# EAGLE design telecommandeV (EAGLE 8.0.2)
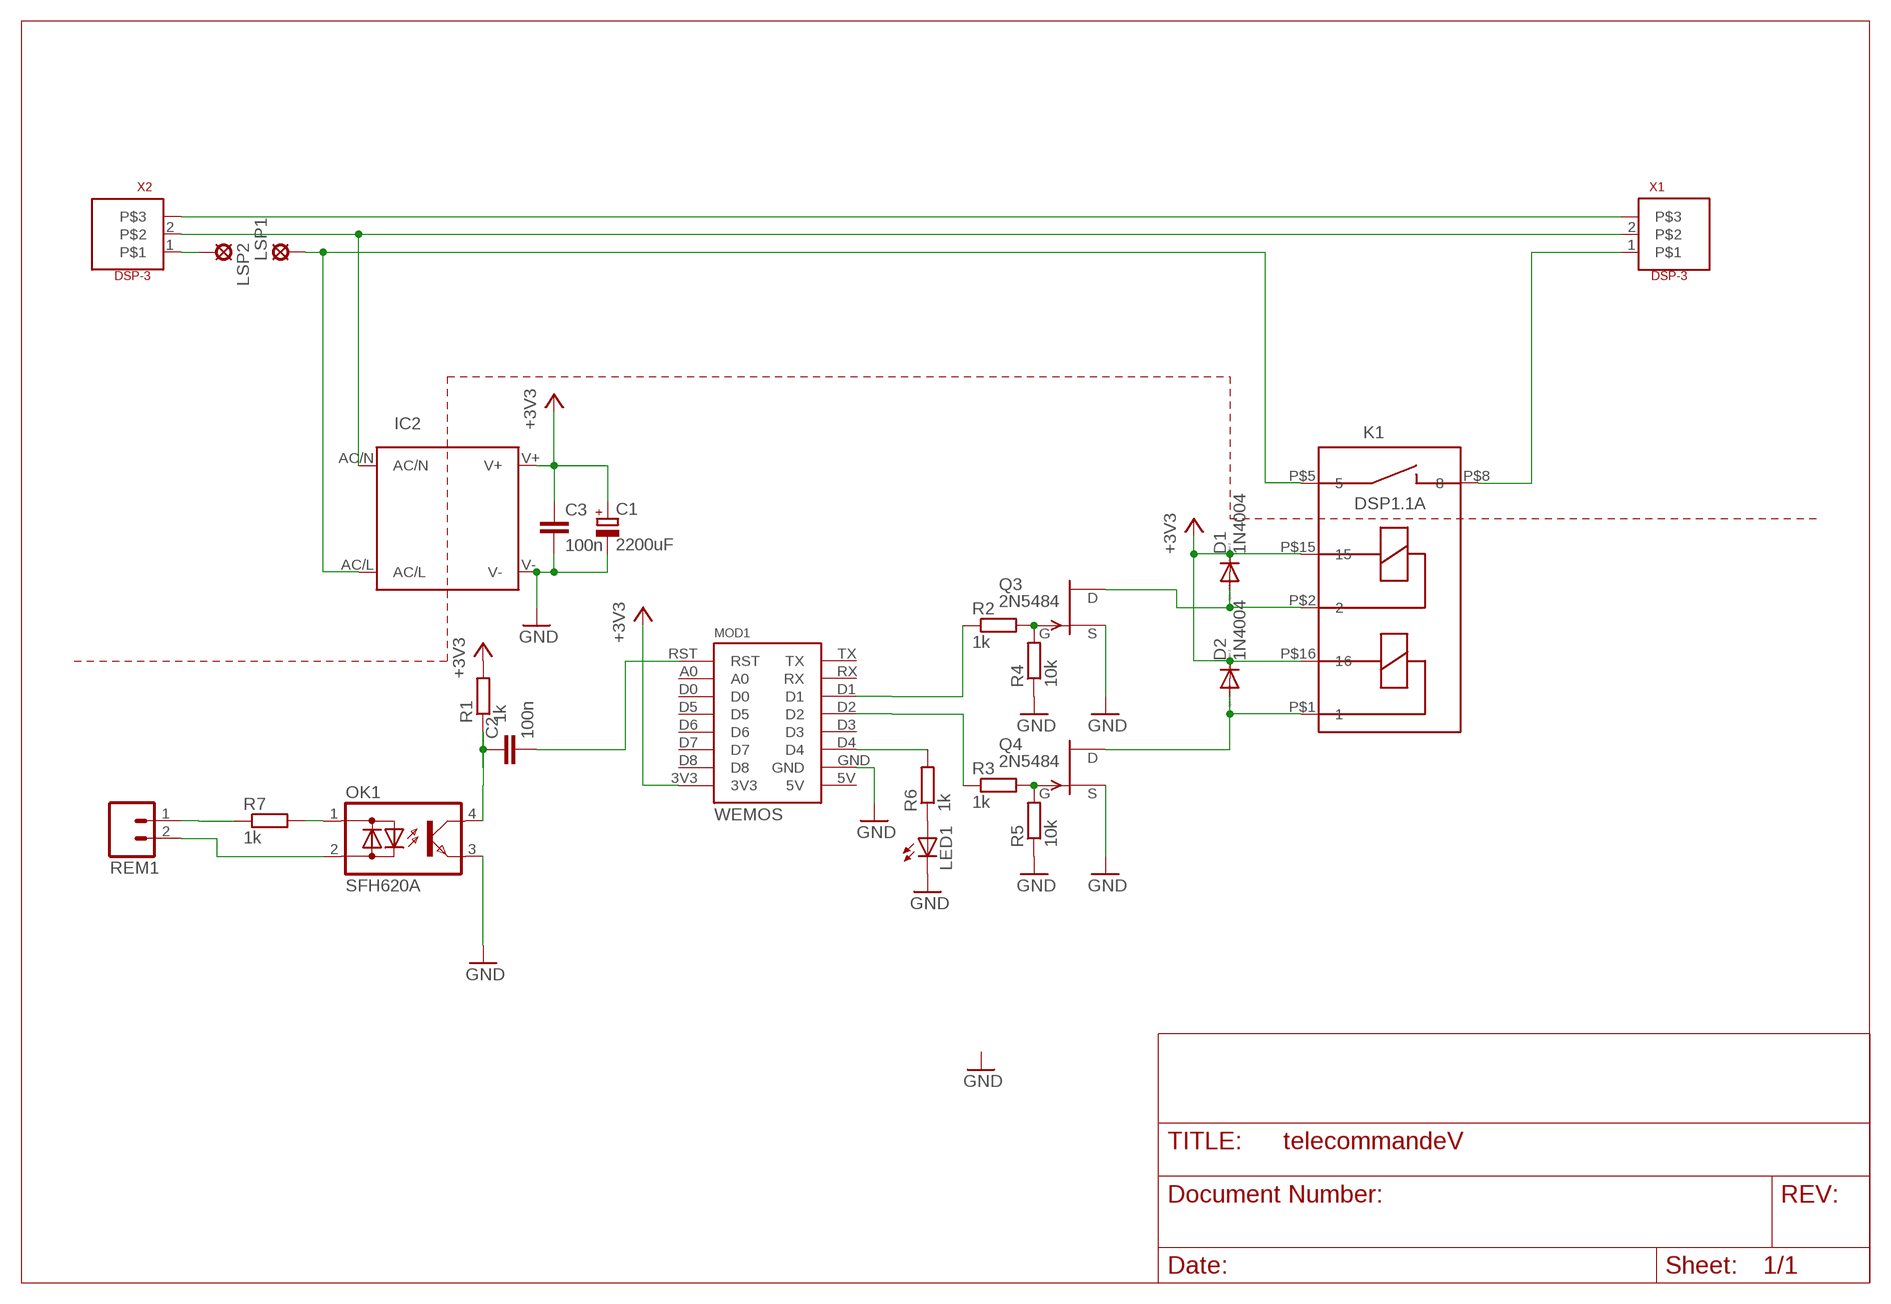
[diagram p0: schematic, sheet 1]

## Parts
C1  2200uF  CPOL-EUE3.5-10  [E3,5-10]
C2  100n  C-EU025-024X044  [C025-024X044]
C3  100n  C-EU025-024X044  [C025-024X044]
D1  1N4004  [DO41-10]
D2  1N4004  [DO41-10]
IC2  IRM_03  [IRM_03]
K1  DSP1.1A  [DSP1A]
LED1  LED3MM  [LED3MM]
LSP1  SE14  [SE14]
LSP2  SE14  [SE14]
MOD1  WEMOS  [WEMOS]
OK1  SFH620A  [DIL04]
Q3  2N5484  [TO92-]
Q4  2N5484  [TO92-]
R1  1k  R-EU_0204/7  [0204/7]
R2  1k  R-EU_0204/7  [0204/7]
R3  1k  R-EU_0204/7  [0204/7]
R4  10k  R-EU_0204/7  [0204/7]
R5  10k  R-EU_0204/7  [0204/7]
R6  1k  R-EU_0204/7  [0204/7]
R7  1k  R-EU_0207/10  [0207/10]
REM1  M025MM  [SCREWTERMINAL-5MM-2]
X1  DSP-3  [RND-CONNECT-3]
X2  DSP-3  [RND-CONNECT-3]

## Nets
+3V3: C1.+ C3.1 D1.C D2.C IC2.V+ K1.P$15 K1.P$16 MOD1.3V3 R1.2
GND: C1.- C3.2 IC2.V- LED1.K(C) MOD1.GND OK1.3(E) Q3.2(S) Q4.2(S) R4.1 R5.1
MASSE [RESEAU]: X1.3 X2.3
N$1: Q3.1(G) R2.2 R4.2
N$2: Q4.1(G) R3.2 R5.2
N$3: D1.A K1.P$2 Q3.3(D)
N$4: MOD1.D4 R6.2
N$5: C2.2 MOD1.RST
N$6: D2.A K1.P$1 Q4.3(D)
N$8 [RESEAU]: K1.P$8 X1.1
N$9: R7.1 REM1.1
N$10: LED1.A R6.1
N$11: OK1.1(AC1) R7.2
N$12: MOD1.D1 R2.1
N$13: MOD1.D2 R3.1
N$15: OK1.2(AC2) REM1.2
N$16: C2.1 OK1.4(C) R1.1
NEUTRE [RESEAU]: IC2.AC/N X1.2 X2.2
PHASE [RESEAU]: LSP2.MP X2.1
PHASE_B [RESEAU]: IC2.AC/L K1.P$5 LSP1.MP
Unconnected: MOD1.5V MOD1.A0 MOD1.D0 MOD1.D3 MOD1.D5 MOD1.D6 MOD1.D7 MOD1.D8 MOD1.RX MOD1.TX

## Library data of the parts
C1 = rcl:CPOL-EU: POLARIZED CAPACITOR, European symbol
C2 C3 = rcl:C-EU: CAPACITOR, European symbol
D1 D2 = diode:1N4004: DIODE general purpose rectifier, 1 A
IC2 = meanwell_irm_v6:IRM_03: 3 watt IRM 03 Vout [V] Imax [A] Pmax [W] Eff [%] 3.3 0.9 3 68 5 0.6 3 72 9 0.33 3 77 12 0.25 3 78 15 0.2 3 78 24 0.125 3 80
K1 = nicolas:DSP1.1
LED1 = led:LED: LED OSRAM: - CHIPLED LG R971, LG N971, LY N971, LG Q971, LY Q971, LO R971, LY R971 LH N974, LH R974 LS Q976, LO Q976, LY Q976 LO Q996 - Hyper CHIPLED LW Q18S LB Q993, LB Q99A, LB R99A - SideLED LS A670, LO A670, LY A670, LG A670, LP A670 LB A673, LV A673, LT A673, LW A673 LH A674 LY A675 LS A676, LA A676, LO A676, LY A676, LW A676 LS A679, LY A679, LG A679 - Hyper Micro SIDELED® LS Y876, LA Y876, LO Y876, LY Y876 LT Y87S - SmartLED LW L88C, LW L88S LB L89C, LB L89S, LG L890 LS L89K, LO L89K, LY L89K LS L896, LA L896, LO L896, LY L896 - TOPLED LS T670, LO T670, LY T670, LG T670, LP T670 LSG T670, LSP T670, LSY T670, LOP T670, LYG T670 LG T671, LOG T671, LSG T671 LB T673, LV T673, LT T673, LW T673 LH T674 LS T676, LA T676, LO T676, LY T676, LB T676, LH T676, LSB T676, LW T676 LB T67C, LV T67C, LT T67C, LS T67K, LO T67K, LY T67K, LW E67C LS E67B, LA E67B, LO E67B, LY E67B, LB E67C, LV E67C, LT E67C LW T67C LS T679, LY T679, LG T679 LS T770, LO T770, LY T770, LG T770, LP T770 LB T773, LV T773, LT T773, LW T773 LH T774 LS E675, LA E675, LY E675, LS T675 LS T776, LA T776, LO T776, LY T776, LB T776 LHGB T686 LT T68C, LB T68C - Hyper Mini TOPLED® LB M676 - Mini TOPLED Santana® LG M470 LS M47K, LO M47K, LY M47K Source: http://www.osram.convergy.de LUXEON: - LUMILED® LXK2-PW12-R00, LXK2-PW12-S00, LXK2-PW14-U00, LXK2-PW14-V00 LXK2-PM12-R00, LXK2-PM12-S00, LXK2-PM14-U00 LXK2-PE12-Q00, LXK2-PE12-R00, LXK2-PE12-S00, LXK2-PE14-T00, LXK2-PE14-U00 LXK2-PB12-K00, LXK2-PB12-L00, LXK2-PB12-M00, LXK2-PB14-N00, LXK2-PB14-P00, LXK2-PB14-Q00 LXK2-PR12-L00, LXK2-PR12-M00, LXK2-PR14-Q00, LXK2-PR14-R00 LXK2-PD12-Q00, LXK2-PD12-R00, LXK2-PD12-S00 LXK2-PH12-R00, LXK2-PH12-S00 LXK2-PL12-P00, LXK2-PL12-Q00, LXK2-PL12-R00 Source: www.luxeon.com KINGBRIGHT: KA-3528ASYC Source: www.kingbright.com
LSP1 LSP2 = solpad:SE14: SOLDER PAD E1553, drill 1,4mm, distributor Buerklin, 07F820
MOD1 = wemos:WEMOS
OK1 = optocoupler:SFH620: Optocoupler, Phototransistor Output, AC Input Source: http://www.vishay.com/docs/83675/sfh620.pdf; MPN: SFH620A-2; OC_FARNELL: 1469594; OC_NEWARK: 97K9546
Q3 Q4 = transistor-fet:?548*: N-Channel JFETs Source: VISHAY 2N5484.pdf Compatible: TO92 2N5245 J304 J305 U310 J308 J309 J310 TO72 2N4416 2N4416A 2N3823 2N4351 3N169 3N170 3N171 MFE3002 TO18 2N3796 2N3797 MFE825 Source: Motorola European Master Guide Pacge 3-59
R1-R7 = rcl:R-EU_: RESISTOR, European symbol
REM1 = SparkFun-Connectors:M02: Standard 2-pin 0.1" header. Use with - straight break away headers ( PRT-00116) - right angle break away headers (PRT-00553) - swiss pins (PRT-00743) - machine pins (PRT-00117) - female headers (PRT-00115) Molex polarized connector foot print use with: PRT-08233 with associated crimp pins and housings. 2.54_SCREWTERM for use with PRT-10571. 3.5mm Screw Terminal footprints for PRT-08084 5mm Screw Terminal footprints for use with PRT-08432; STOREFRONT_ID: PRT-08432
X1 X2 = nicolas:DSP-3

## Net classes
0 default: width 0.61 mm, drill 0.5 mm, clearance 0.5 mm
1 RESEAU: width 1 mm, drill 1 mm, clearance 1 mm

## Board
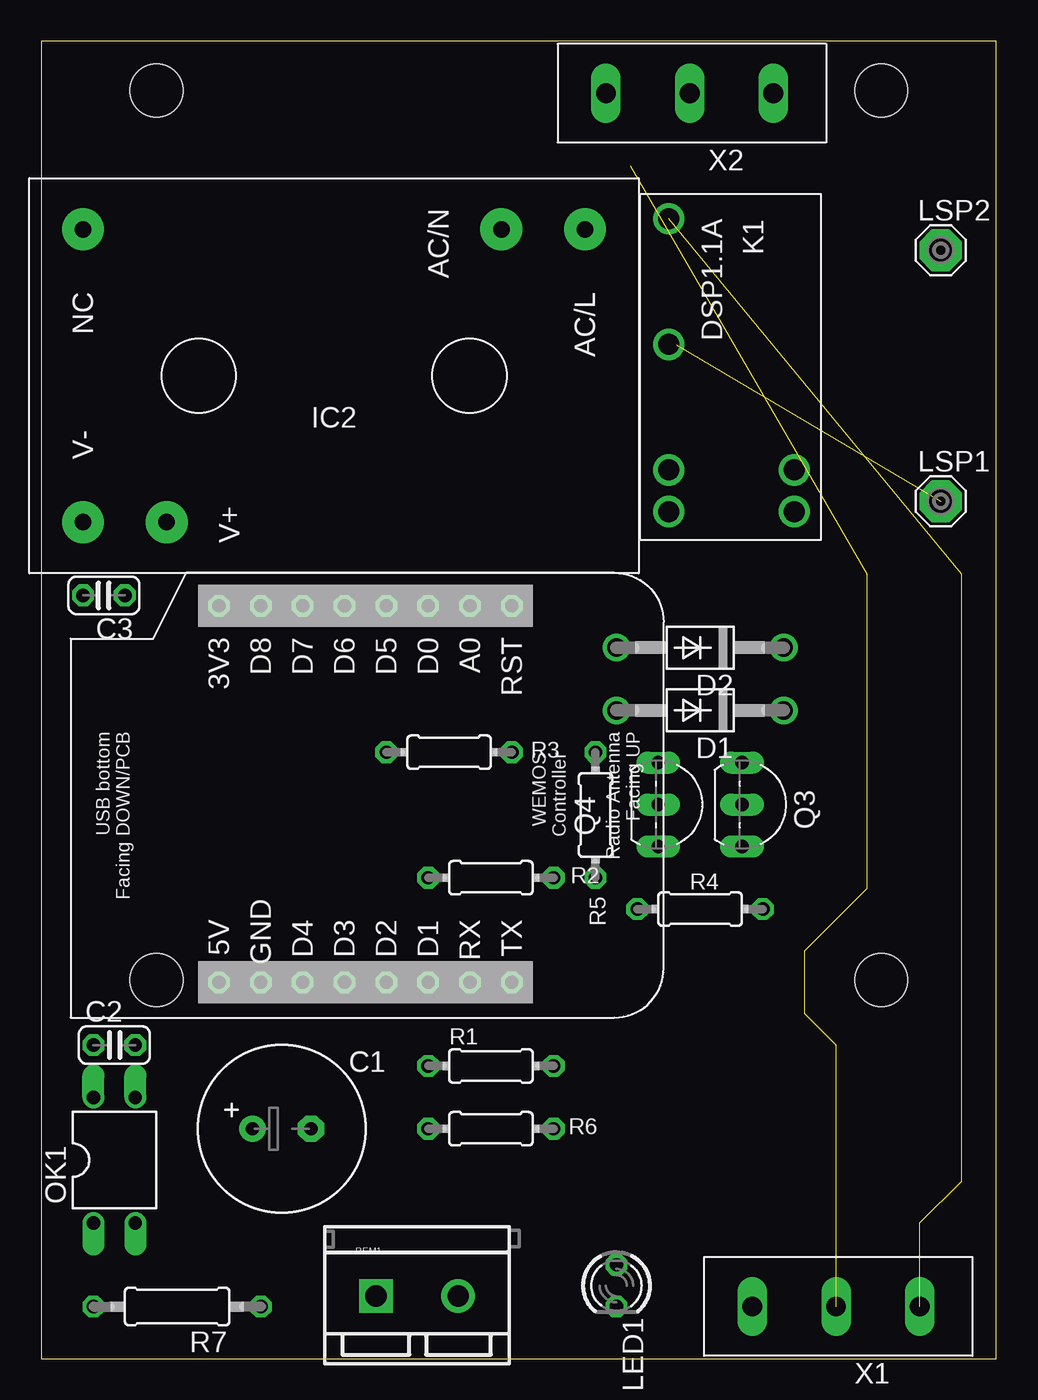
[diagram p1: board, top side]
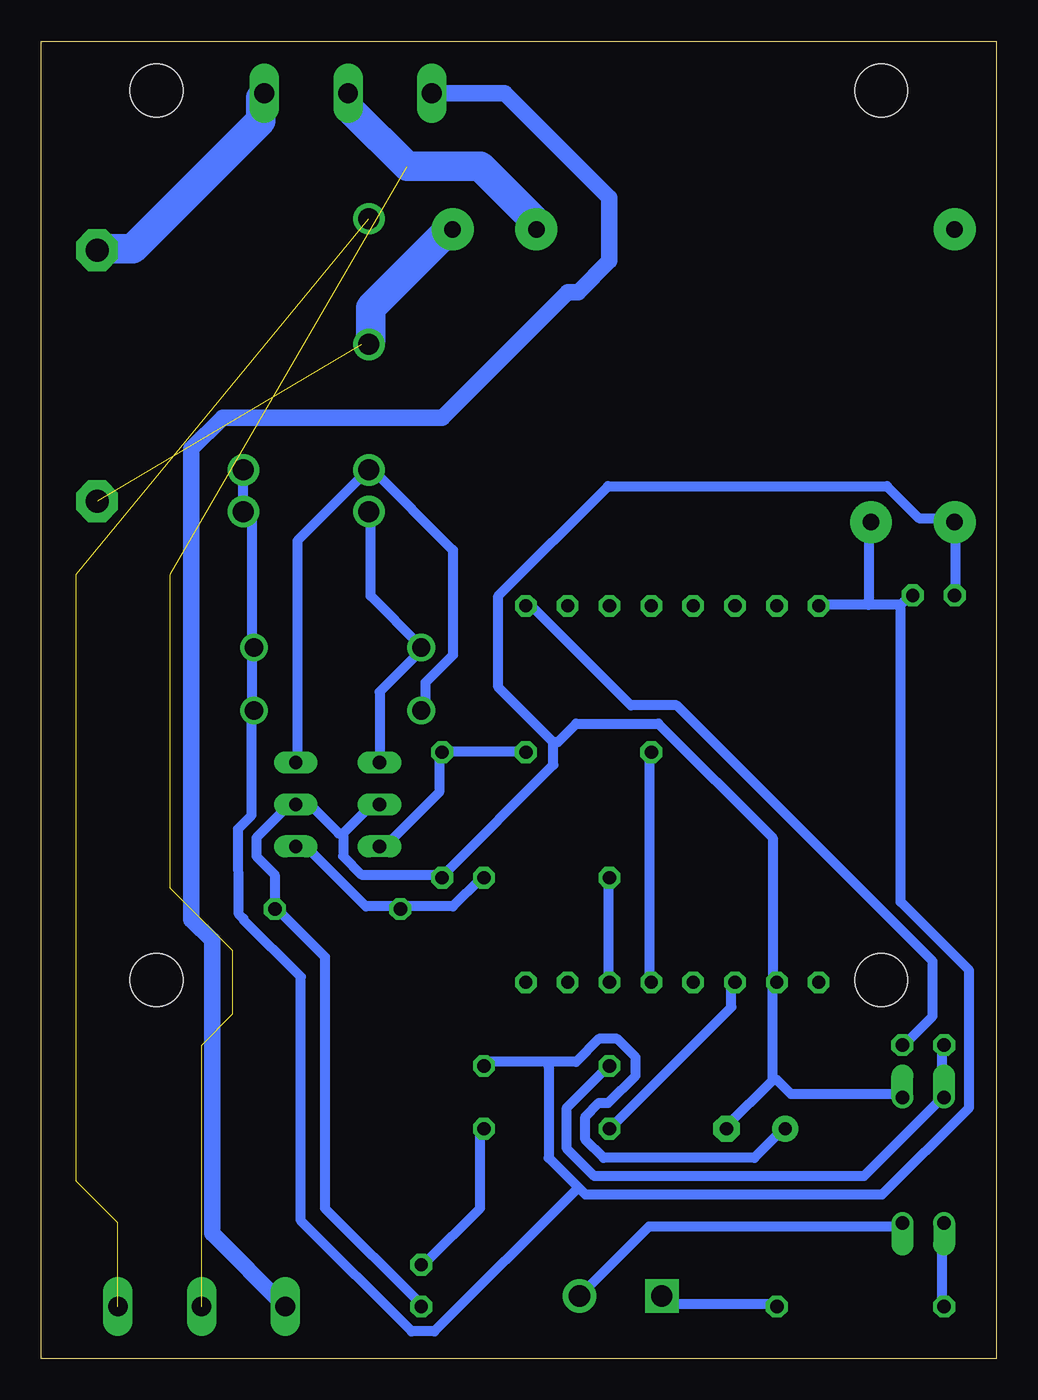
[diagram p2: board, bottom side, seen from below]

Size 58 x 80 mm. Coordinates in mm from the lower left corner, seen from the top.
Outline: 0,0 58,0 58,80 0,80 0,0
Copper layers (1*16): Top 0.035mm / dielectric 1.5mm / Bottom 0.035mm
Design rules "default": minimum track width 10mil, minimum drill 24mil, track to track 8mil, track to pad 8mil, pad to pad 8mil, via to via 8mil, smd to smd 8mil, copper to edge 40mil, drill to drill 8mil, minimum pad ring 10mil, minimum via ring 8mil, stop-mask expansion 4mil, vias tented up to drill 0mil, thermal gap 10mil
Holes 3.2 mm at 7,23 51,23 7,77 51,77

### Footprints (pad centres in the part's own frame; a part is rotated, then mirrored left to right if it is on the bottom)
E3,5-10 = drill 0.813 pad 1.6: + -1.778,0 | drill 0.813 pad 1.6 octagon: - 1.778,0
C025-024X044 = drill 0.813 octagon: 1 -1.27,0; 2 1.27,0
DO41-10 = drill 1.118: A 5.08,0; C -5.08,0
IRM_03 = drill 1 pad 2.54: AC/L -15.24,-8.89; AC/N -10.16,-8.89; NC 15.24,-8.89; V+ 10.16,8.89; V- 15.24,8.89
DSP1A = drill 1.27: P$1 17.78,0; P$2 15.24,0; P$5 7.62,0; P$8 0,0; P$15 15.24,7.62; P$16 17.78,7.62
LED3MM = drill 0.813 octagon: A -1.27,0; K 1.27,0
SE14 = drill 1.397 pad 2.54 octagon: MP 0,0
WEMOS = drill 0.8 octagon: 3V3 0,0; 5V 22.86,0; A0 0,15.24; D0 0,12.7; D1 22.86,12.7; D2 22.86,10.16; D3 22.86,7.62; D4 22.86,5.08; D5 0,10.16; D6 0,7.62; D7 0,5.08; D8 0,2.54; GND 22.86,2.54; RST 0,17.78; RX 22.86,15.24; TX 22.86,17.78
DIL04 = drill 0.813 offset: 1 -1.27,-3.81; 2 1.27,-3.81; 3 1.27,3.81; 4 -1.27,3.81
TO92- = drill 0.813 long: 1 2.54,0; 2 0,0; 3 -2.54,0
0204/7 = drill 0.813 octagon: 1 -3.81,0; 2 3.81,0
0207/10 = drill 0.813 octagon: 1 -5.08,0; 2 5.08,0
SCREWTERMINAL-5MM-2 = drill 1.3 pad 2.032 square: 1 0,0 | drill 1.3 pad 2.032: 2 5,0
RND-CONNECT-3 = drill 1.2 long: 1 0,0; 2 5.08,0; 3 10.16,0

### Placement (x,y rotation side)
C1  14.61,13.97 0 top
C2  4.45,19.05 0 top
C3  3.81,46.35 180 top
D1  40.01,39.37 180 top
D2  40.01,43.18 180 top
IC2  17.78,59.69 180 top
K1  38.1,69.22 270 top
LED1  34.92,4.45 270 top
LSP1  54.61,52.07 0 top
LSP2  54.61,67.31 0 top
MOD1  10.79,45.72 270 top
OK1  4.45,12.06 0 top
Q3  42.55,33.66 270 top
Q4  37.47,33.66 270 top
R1  27.3,17.78 0 top
R2  27.3,29.21 0 top
R3  24.77,36.83 0 top
R4  40.01,27.3 180 top
R5  33.66,33.02 90 top
R6  27.3,13.97 180 top
R7  8.26,3.17 180 top
REM1  20.32,3.81 0 top
X1  53.34,3.17 180 top
X2  44.45,76.83 180 top

### Tracks (layer width: path | path; a pad name or v marks a point on that pad's centre or on a via)
+3V3
  Bottom 0.61: 5.83,45.77 7.77,45.77 | 7.77,45.77 10.54,45.77 MOD1.3V3 | 5.83,45.77 5.27,46.33 C3.1 | 7.77,45.77 7.77,46.05 7.77,50.76 IC2.V+ | 27.18,18.03 25.52,18.03 24.13,19.42 23.02,19.42 21.91,18.31 21.91,17.2 23.58,15.53 24.13,15.53 24.97,14.7 24.97,13.31 23.86,12.21 14.7,12.21 13.04,13.87 C1.+ | 27.18,18.03 31.07,18.03 R1.2 | 25.38,10.4 27.18,12.21 27.18,17.75 27.18,18.03 | 25.38,10.4 24.97,9.99 6.93,9.99 1.66,15.26 1.66,23.58 5.83,27.74 5.83,45.49 5.83,45.77 | K1.P$15 45.77,53.82 45.77,51.6 K1.P$16 45.49,51.32 45.22,51.04 45.22,43.27 D2.C 45.22,43 45.22,39.39 D1.C 45.22,39.11 45.22,33.01 46.05,32.18 46,27 45.72,26.72 45.72,26.67 42.24,23.19 42.24,8.4 35.51,1.66 34.12,1.66 25.52,10.26 25.38,10.4
GND
  Bottom 0.61: LED1.K 34.95,3.33 40.78,9.15 40.78,24.41 43.55,27.18 R4.1 43.83,27.46 43.83,29.4 44.94,30.51 44.94,31.62 42.72,33.84 Q3.2 42.44,33.56 41.61,33.56 39.95,31.9 39.67,31.9 | 13.59,16.92 13.59,22.75 MOD1.GND 13.59,23.02 13.59,31.62 20.53,38.56 25.52,38.56 26.63,37.45 26.91,37.45 | 13.59,16.92 16.37,14.15 C1.- | OK1.3 5.83,16.09 12.48,16.09 13.31,16.92 13.59,16.92 | C3.2 2.5,46.6 2.5,50.76 IC2.V- 2.77,51.04 4.72,51.04 6.66,52.98 23.58,52.98 30.24,46.33 30.24,40.78 26.91,37.45 | 39.67,31.9 39.67,30.51 38.56,29.4 33.84,29.4 R5.1 33.56,29.4 26.91,36.06 26.91,37.45 | 39.67,31.9 37.73,33.84 Q4.2
MASSE
  Bottom 1.016: X2.3 29.84,76.83 23.5,70.48 23.5,66.67 25.4,64.77 26.04,64.77 33.66,57.15 46.99,57.15 48.9,55.24 48.9,26.67 47.62,25.4 47.62,7.62 X1.3
N$1
  Bottom 0.61: R2.2 31.35,29.13 33.01,27.46 36.06,27.46 R4.2 36.34,27.46 38.28,27.46 41.89,31.07 42.44,31.07 Q3.1
N$2
  Bottom 0.61: Q4.1 37.45,31.35 36.89,31.35 33.84,34.4 33.84,36.62 R5.2 33.56,36.89 28.85,36.89 R3.2
N$3
  Bottom 0.61: Q3.3 42.44,36.34 42.44,49.66 38.28,53.82 K1.P$2 38,54.09 33.01,49.1 33.01,42.72 34.67,41.05 34.67,39.39 D1.A
N$4
  Bottom 0.61: MOD1.D4 16.09,22.75 16.09,21.36 23.3,14.15 R6.2
N$5
  Bottom 0.61: MOD1.RST 28.57,45.49 28.02,45.49 22.19,39.67 19.42,39.67 3.88,24.13 3.88,20.8 5.55,19.14 C2.2
N$6
  Bottom 0.61: Q4.3 37.45,36.34 37.45,40.5 34.95,43 D2.A 34.95,43.27 38,46.33 38,51.32 K1.P$1
N$8  (4 unrouted)
N$9
  Bottom 0.61: R7.1 13.59,3.33 19.97,3.33 20.25,3.61 REM1.1
N$10
  Bottom 0.61: R6.1 31.35,13.87 31.35,9.15 34.67,5.83 LED1.A
N$11
  Bottom 0.61: R7.2 3.33,3.33 3.33,8.04 OK1.1
N$12
  Bottom 0.61: MOD1.D1 23.58,23.02 23.58,29.13 R2.1
N$13
  Bottom 0.61: MOD1.D2 21.08,23.02 21.08,36.62 R3.1
N$15
  Bottom 0.61: OK1.2 5.83,8.04 21.08,8.04 25.24,3.88 REM1.2
N$16
  Bottom 0.61: C2.1 3.33,18.86 3.33,16.09 OK1.4 3.33,15.81 8.04,11.1 24.41,11.1 26.08,12.76 26.08,15.26 23.58,17.75 R1.1
NEUTRE  (6 unrouted)
  Bottom 1: 39.11,75.73 39.11,76.56 X2.2 | 27.74,68.8 IC2.AC/N
  Bottom 1.778: 39.11,75.73 35.78,72.4 31.35,72.4 27.74,68.8
PHASE
  Bottom 1: 44.66,76.56 X2.1
  Bottom 1.016: 54.51,67.41 LSP2.MP
  Bottom 1.778: 44.66,76.56 44.66,75.17 52.43,67.41 54.51,67.41
PHASE_B  (1 unrouted)
  Bottom 1: 38,61.86 K1.P$5 38.56,61.58 | 33.29,68.52 IC2.AC/L
  Bottom 1.778: 38,61.86 38,63.8 33.29,68.52